# EAGLE design mainplate (EAGLE 8.6.0)
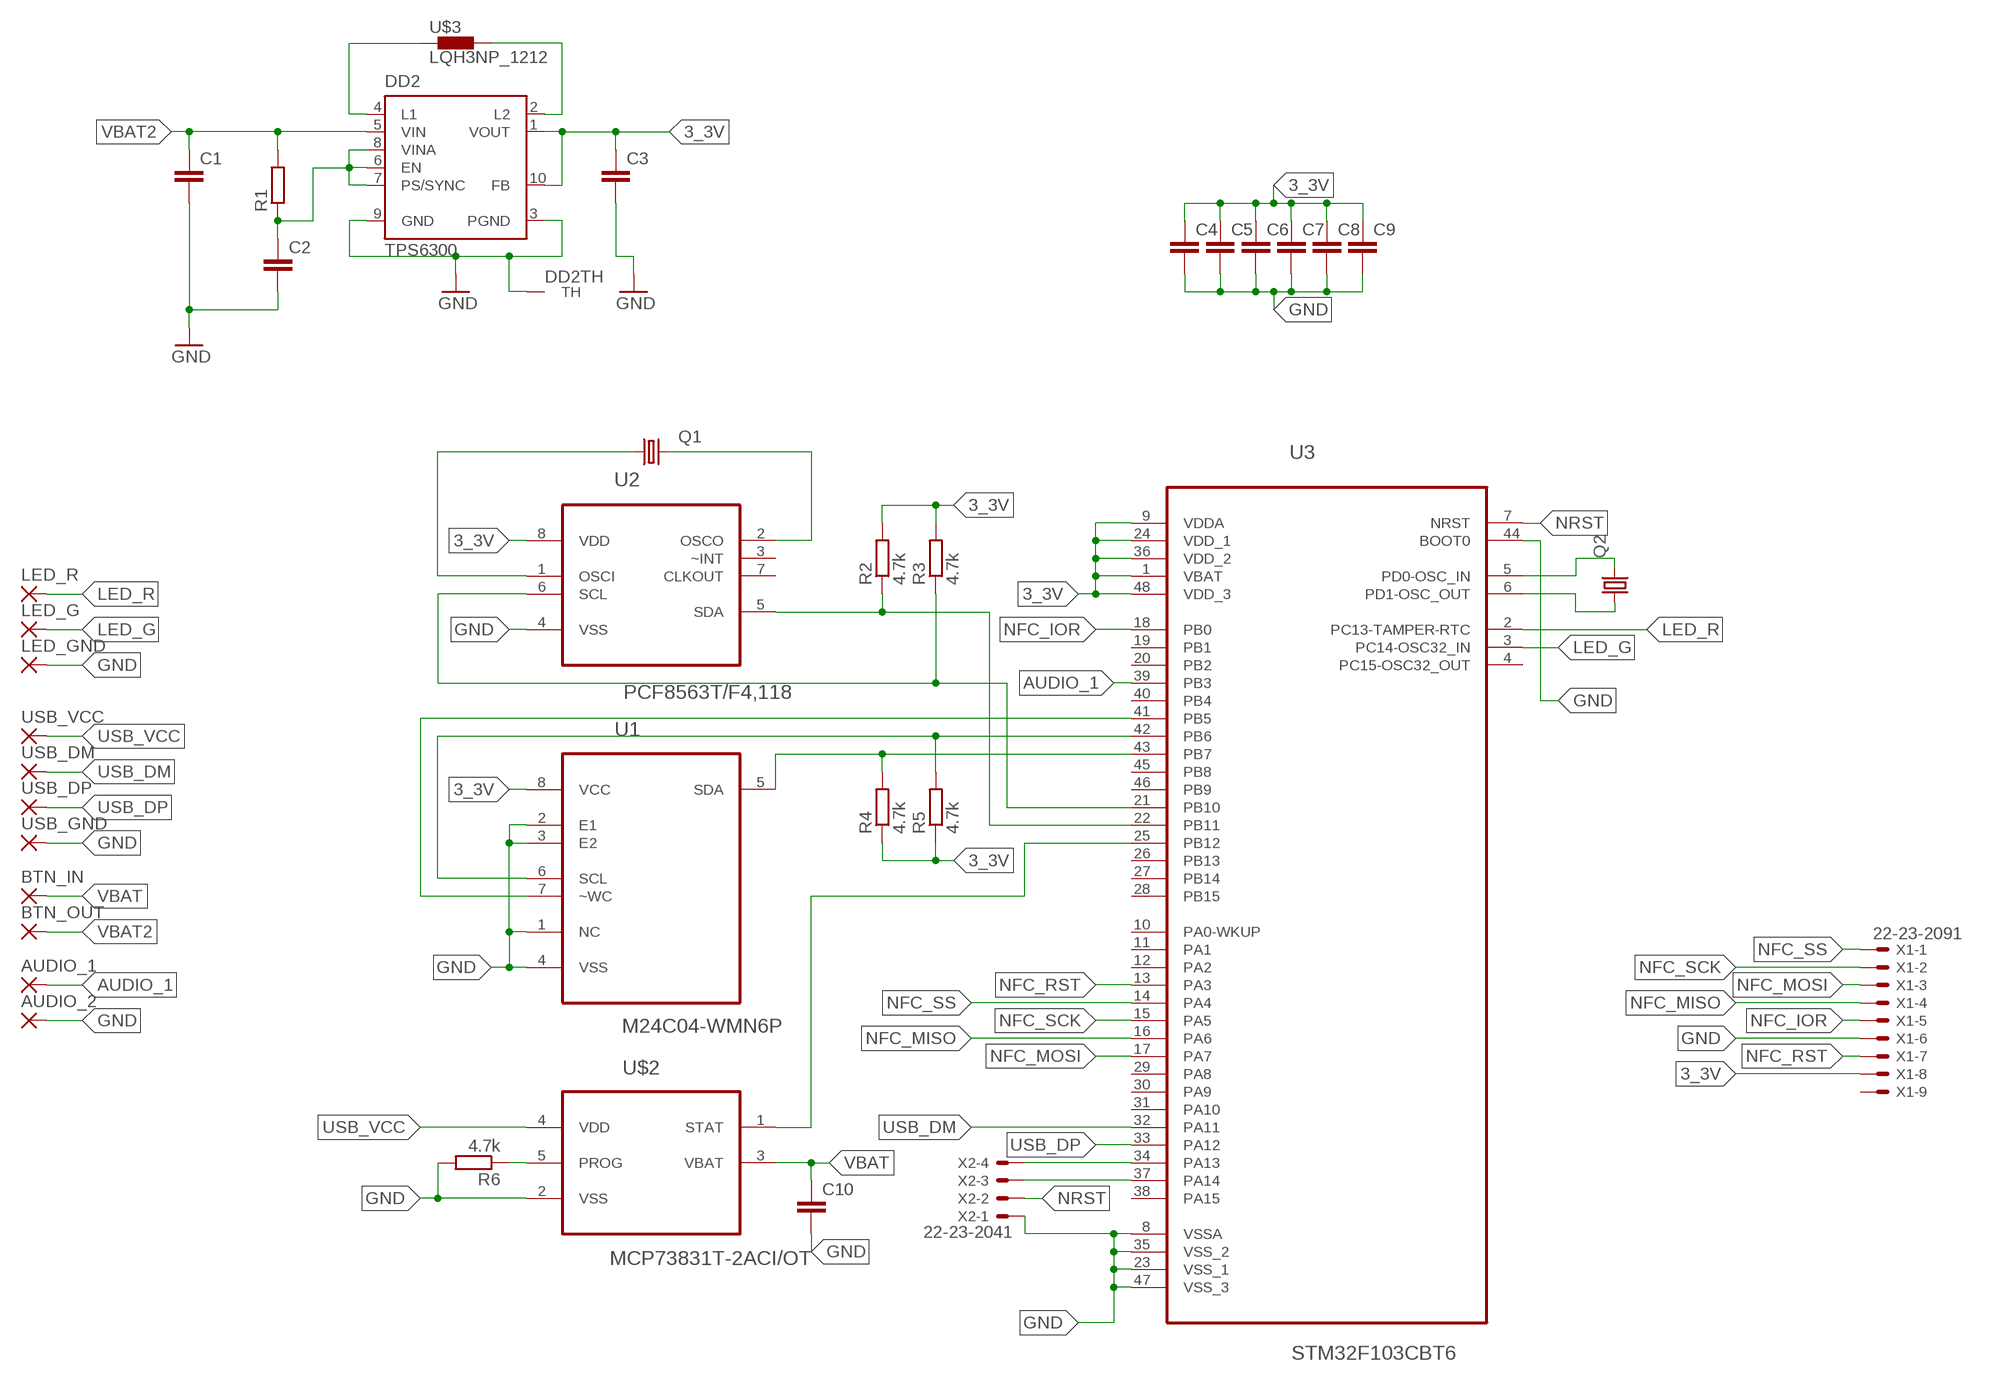
[diagram p0: schematic, sheet 1]

## Parts
AUDIO_1  2,54/1,0  [2,54/1,0]
AUDIO_2  2,54/1,0  [2,54/1,0]
BTN_IN  2,54/1,0  [2,54/1,0]
BTN_OUT  2,54/1,0  [2,54/1,0]
C1  C-EUC0603  [C0603]
C2  C-EUC0603  [C0603]
C3  C-EUC0603  [C0603]
C4  C-EUC0603  [C0603]
C5  C-EUC0603  [C0603]
C6  C-EUC0603  [C0603]
C7  C-EUC0603  [C0603]
C8  C-EUC0603  [C0603]
C9  C-EUC0603  [C0603]
C10  C-EUC0603  [C0603]
DD2  TPS6300  [DRC-S-PVSON-N10]
LED_G  2,54/1,0  [2,54/1,0]
LED_GND  2,54/1,0  [2,54/1,0]
LED_R  2,54/1,0  [2,54/1,0]
Q1  KX-327-NHT  [3.2X1.5]
Q2  KX-K  [11.4X4.5]
R1  R-EU_R0603  [R0603]
R2  4.7k  R-EU_R0603  [R0603]
R3  4.7k  R-EU_R0603  [R0603]
R4  4.7k  R-EU_R0603  [R0603]
R5  4.7k  R-EU_R0603  [R0603]
R6  4.7k  R-EU_R0603  [R0603]
U1  M24C04-WMN6P  [SOIC127P600X175-8N]
U2  PCF8563T/F4,118  [SOIC127P600X175-8N]
U3  STM32F103CBT6  [QFP50P900X900X160-48N]
U$2  MCP73831T-2ACI/OT  [SOT95P280X145-5N]
U$3  LQH3NP_1212  [LQH3NP_1212]
USB_DM  2,54/1,0  [2,54/1,0]
USB_DP  2,54/1,0  [2,54/1,0]
USB_GND  2,54/1,0  [2,54/1,0]
USB_VCC  2,54/1,0  [2,54/1,0]
X1  22-23-2091  [22-23-2091]
X2  22-23-2041  [22-23-2041]

## Nets
3_3V: C3.1 C4.1 C5.1 C6.1 C7.1 C8.1 C9.1 DD2.1(VOUT) DD2.10(FB) R2.2 R3.2 R4.1 R5.1 U1.8(VCC) U2.8(VDD) U3.1(VBAT) U3.9(VDDA) U3.24(VDD_1) U3.36(VDD_2) U3.48(VDD_3) X1.8
AUDIO_1: AUDIO_1.1(P) U3.39(PB3)
EE_WC: U1.7(~WC) U3.41(PB5)
GND: AUDIO_2.1(P) C1.2 C2.2 C3.2 C4.2 C5.2 C6.2 C7.2 C8.2 C9.2 C10.2 DD2.3(PGND) DD2.9(GND) DD2.TH LED_GND.1(P) R6.2 U1.1(NC) U1.2(E1) U1.3(E2) U1.4(VSS) U2.4(VSS) U3.8(VSSA) U3.23(VSS_1) U3.35(VSS_2) U3.44(BOOT0) U3.47(VSS_3) U$2.2(VSS) USB_GND.1(P) X1.6 X2.1
LED_G: LED_G.1(P) U3.3(PC14-OSC32_IN)
LED_R: LED_R.1(P) U3.2(PC13-TAMPER-RTC)
N$1: Q2.2 U3.5(PD0-OSC_IN)
N$2: Q2.1 U3.6(PD1-OSC_OUT)
N$3: DD2.4(L1) U$3.P$1
N$4: R2.1 U2.5(SDA) U3.22(PB11)
N$5: DD2.2(L2) U$3.P$2
N$6: R3.1 U2.6(SCL) U3.21(PB10)
N$7: R4.2 U1.5(SDA) U3.43(PB7)
N$8: C2.1 DD2.6(EN) DD2.7(PS/SYNC) DD2.8(VINA) R1.1
N$9: R5.2 U1.6(SCL) U3.42(PB6)
N$10: Q1.1 U2.1(OSCI)
N$11: Q1.2 U2.2(OSCO)
N$12: R6.1 U$2.5(PROG)
N$13: U3.34(PA13) X2.4
N$14: U3.37(PA14) X2.3
N$15: U3.25(PB12) U$2.1(STAT)
NFC_IOR: U3.18(PB0) X1.5
NFC_MISO: U3.16(PA6) X1.4
NFC_MOSI: U3.17(PA7) X1.3
NFC_RST: U3.13(PA3) X1.7
NFC_SCK: U3.15(PA5) X1.2
NFC_SS: U3.14(PA4) X1.1
NRST: U3.7(NRST) X2.2
USB_DM: U3.32(PA11) USB_DM.1(P)
USB_DP: U3.33(PA12) USB_DP.1(P)
USB_VCC: U$2.4(VDD) USB_VCC.1(P)
VBAT: BTN_IN.1(P) C10.1 U$2.3(VBAT)
VBAT2: BTN_OUT.1(P) C1.1 DD2.5(VIN) R1.2
Unconnected: U2.3(~INT) U2.7(CLKOUT) U3.4(PC15-OSC32_OUT) U3.10(PA0-WKUP) U3.11(PA1) U3.12(PA2) U3.19(PB1) U3.20(PB2) U3.26(PB13) U3.27(PB14) U3.28(PB15) U3.29(PA8) U3.30(PA9) U3.31(PA10) U3.38(PA15) U3.40(PB4) U3.45(PB8) U3.46(PB9) X1.9

## Library data of the parts
AUDIO_1 AUDIO_2 BTN_IN BTN_OUT LED_G LED_GND LED_R USB_DM USB_DP USB_GND USB_VCC = wirepad:2,54/1,0: THROUGH-HOLE PAD
C1-C10 = resistor:C-EU: CAPACITOR, European symbol
DD2 = texas:TPS6300*: HIGH EFFICIENT SINGLE INDUCTOR BUCK-BOOST CONVERTER WITH 1.8-A SWITCHES Source: http://focus.ti.com/lit/ds/symlink/tps63001.pdf; MPN: TPS63000DRCTG4; OC_FARNELL: 1511852; OC_NEWARK: 59M7217
Q1 = crystal-geyer_V1_0:KX-327: Tuning Fork Crystals (kHz) SMD: KX327 - Serie Model Size l/w/h [mm] Frequency Range Frequency Stability Temp. Range [°C] Load Capacitance AECQ 200 availabel Datasheet KX-327VT KX-327FT KX-327RT KX-327NHT KX-327NHF KX-327L KX-327S 1.25/1.05/0.5 1.6/1.0/0.5 2.0/1.2/0.6 3.2/1.5/0.8 3.2/1.5/0.8 7.0/1.5/1.4 8.2/3.8/2.5 32,768 kHz 32,768 kHz 32,768 kHz 32,768 kHz 32,768 kHz 32,768 kHz 32,768 kHz ±10 … ±20ppm ±10 … ±20ppm ±10 … ±20ppm ±10 … ±20ppm ±10 … ±20ppm ±10 … ±20ppm ±5 … ±20ppm (*) -40°C …+85°C (*) -40°C …+85°C (*) -40°C …+85°C (*) -40°C …+85°C (*) -40°C …+125°C (*) -40°C …+85°C (*) -40°C …+85°C 7/9/12,5 7/9/12,5 7/9/12,6 7/9/12,5 9/12,5 7/9/12,5 6/12,5 - - - - yes - - KX-327VT.pdf <http://www.geyer-electronic.de/uploads/tx_userartikelfrequenz/GEYER-KX-327VT.pdf> KX-327FT.pdf <http://www.geyer-electronic.de/uploads/tx_userartikelfrequenz/GEYER-KX-327FT.pdf> KX-327RT.pdf <http://www.geyer-electronic.de/uploads/tx_userartikelfrequenz/GEYER-KX-327RT.pdf> KX-327NHT.pdf <http://www.geyer-electronic.de/uploads/tx_userartikelfrequenz/GEYER-KX-327NHT.pdf> KX-327NHF.pdf <http://www.geyer-electronic.de/uploads/tx_userartikelfrequenz/GEYER-KX-327NHF.pdf> KX-327L.pdf <http://www.geyer-electronic.de/uploads/tx_userartikelfrequenz/GEYER-KX-327L.pdf> KX-327S.pdf <http://www.geyer-electronic.de/uploads/tx_userartikelfrequenz/GEYER-KX-327S.pdf> <http://www.geyer-electronic.de/fileadmin/template/img/logo-geyer-electronic.png> Details see: http://www.geyer-electronic.de/Frequenz-Produkte.9.0.html Created 2016-06-07, Hans Locher 2016 (C) Geyer Quartz Technology KX327VT,KX327FT,KX327RT,KX327NHT,KX327NHF,KX327S,KX327L;125105;1610;2012;3215;7015;8238;1,25x1,05,1.25x1.05;1,6x1,0,1.6x1.0;2,0x1,2,2.0x1.2;3,2x1,5,3.2x1.5;8,2x3,8,8.2x3.8,7.0x1.5,7,0x1,532.768kHz
Q2 = crystal-geyer_V1_0:KX: Quartz Crystals (MHz) SMD: KX - Serie Model Size l/w/h [mm] Frequency Range Frequency Stability Temp. Range [°C] Load Capacitance AECQ 200 availabel Datasheet KX-4 KX-5 KX-6 KX-7 KX-9A KX-9B KX-12A KX-12B KX-13 KX-20 KX-K KX-KS 1.6/1.2/0.3 2.0/1.6/0.45 2.5/2.0/0.55 3.2/2.5/0.8 5.0/3.2/1.0 5.0/3.2/1.1 6.0/3.5/1.1 6.0/3.5/1.0 7.0/5.0 /1.3 11.6/5.5/1.6 12.3/4.5/4.2 12.3/4.5/3.2 24.0 ~ 80.0 MHz 16.0 ~ 80.0 MHz 12.0 ~ 80.0 MHz 8.0 ~ 60.0 MHz 7,68 ~ 300,0 MHz 8,0 ~ 50,0 MHz 8,0 ~ 150,0 MHz 8,0 ~ 50,0 MHz 6,0 ~ 160,0 MHz 3,579 ~ 25,0 MHz 3,579 ~ 70,0 MHz 3,579 ~ 70,0 MHz ±10 … ±50ppm ±10 … ±50ppm ±10 … ±50ppm ±10 … ±50ppm ±10 … ±50ppm ±10 … ±50ppm ±10 … ±50ppm ±10 … ±50ppm ±10 … ±50ppm ±50ppm ±10 … ±50ppm ±10 … ±50ppm (*) -40°C …+85°C (*) -40°C …+125°C (*) -40°C …+125°C (*) -40°C …+125°C (*) -40°C …+105°C (*) -40°C …+105°C (*) -40°C …+125°C (*) -40°C …+105°C (*) -40°C …+105°C (*) -40°C …+105°C (*) -40°C …+85°C (*) -40°C …+85°C 8, 8…16 8, 8…16 10, 8…16 12, 7…20 16, 10…20 16, 10…20 16, 10…20 16, 12…20 16, 12…20 16, 12…20 16, 12…30 16, 12…30 - yes yes yes - - - - - - - - KX-4.pdf <http://www.geyer-electronic.de/uploads/tx_userartikelfrequenz/GEYER-KX-4.pdf> KX-5.pdf <http://www.geyer-electronic.de/uploads/tx_userartikelfrequenz/GEYER-KX-5.pdf> KX-6.pdf <http://www.geyer-electronic.de/uploads/tx_userartikelfrequenz/GEYER-KX-6.pdf> KX-7.pdf <http://www.geyer-electronic.de/uploads/tx_userartikelfrequenz/GEYER-KX-7.pdf> KX-9A.pdf <http://www.geyer-electronic.de/uploads/tx_userartikelfrequenz/GEYER-KX-9A.pdf> KX-9B.pdf <http://www.geyer-electronic.de/uploads/tx_userartikelfrequenz/GEYER-KX-9B.pdf> KX-12A.pdf <http://www.geyer-electronic.de/uploads/tx_userartikelfrequenz/GEYER-KX-12A.pdf> KX-12B.pdf <http://www.geyer-electronic.de/uploads/tx_userartikelfrequenz/GEYER-KX-12B.pdf> KX-13.pdf <http://www.geyer-electronic.de/uploads/tx_userartikelfrequenz/GEYER-KX-13.pdf> KX-20.pdf <http://www.geyer-electronic.de/uploads/tx_userartikelfrequenz/GEYER-KX-20.pdf> KX-K.pdf <http://www.geyer-electronic.de/uploads/tx_userartikelfrequenz/GEYER-KX-K.pdf> KX-KS.pdf <http://www.geyer-electronic.de/uploads/tx_userartikelfrequenz/GEYER-KX-KS.pdf> <http://www.geyer-electronic.de/fileadmin/template/img/logo-geyer-electronic.png> Details see: http://www.geyer-electronic.de/Frequenz-Produkte.9.0.html Created 2016-06-07, Hans Locher 2016 (C) Geyer Quartz Technology KX4,KX5,KX6,KX7,KX9A,KX9B,KX12A,KX12B,KX13,KX20,KXK,KXKS;1612;2016;2520;3225;5032;6035;7050;11655;12345;1,6x1,2;2,0x1,6;2,5x2,0;3,2x2,5;5,0x3,2;6,0x3,5;7,0x5,0;11,6x5,5;12,3x4,5;12,3x4,5;1.6x1.2;2.0x1.6;2.5x2.0;3.2x2.5;5.0x3.2;6.0x3.5;7.0x5.0;11.6x5.5;12.3x4.5;12.3x4.5;
R1-R6 = resistor:R-EU_: RESISTOR, European symbol
U1 = ST Microelctronics_By_element14_Batch_1:M24C04-WMN6P: EEPROM; MPN: M24C04-WMN6P; OC_FARNELL: 9882812; OC_NEWARK: 83K1376; PACKAGE: SOIC-8; SUPPLIER: STMICROELECTRONICS
U2 = NXP_By_element14_Batch_1:PCF8563T/F4,118: Real-time clock/calendar; MPN: PCF8563T/F4,118; OC_FARNELL: 1826830; OC_NEWARK: 78R6249; PACKAGE: SOIC-8; SUPPLIER: NXP Semiconductors
U3 = ST Microelctronics_By_element14_Batch_1:STM32F103CBT6: Medium-density performance line ARM-based 32-bit MCU; MPN: STM32F103CBT6; OC_FARNELL: 1606327; OC_NEWARK: 11N8296; PACKAGE: QFP-48; SUPPLIER: STMICROELECTRONICS
U$2 = Microchip_By_element14_Batch_1:MCP73831T-2ACI/OT: Charge Management Controller; MPN: MCP73831T-2ACI/OT; OC_FARNELL: 1332158; OC_NEWARK: 56K7045; PACKAGE: SOT-5; SUPPLIER: Microchip
U$3 = inductors:LQH3NP_1212
X1 = con-molex:22-23-2091: .100" (2.54mm) Center Header - 9 Pin; MF: MOLEX; MPN: 22-23-2091; OC_FARNELL: 1756827; OC_NEWARK: 56H0450
X2 = con-molex:22-23-2041: .100" (2.54mm) Center Header - 4 Pin; MF: MOLEX; MPN: 22-23-2041; OC_FARNELL: 1462920; OC_NEWARK: 38C0355

## Board
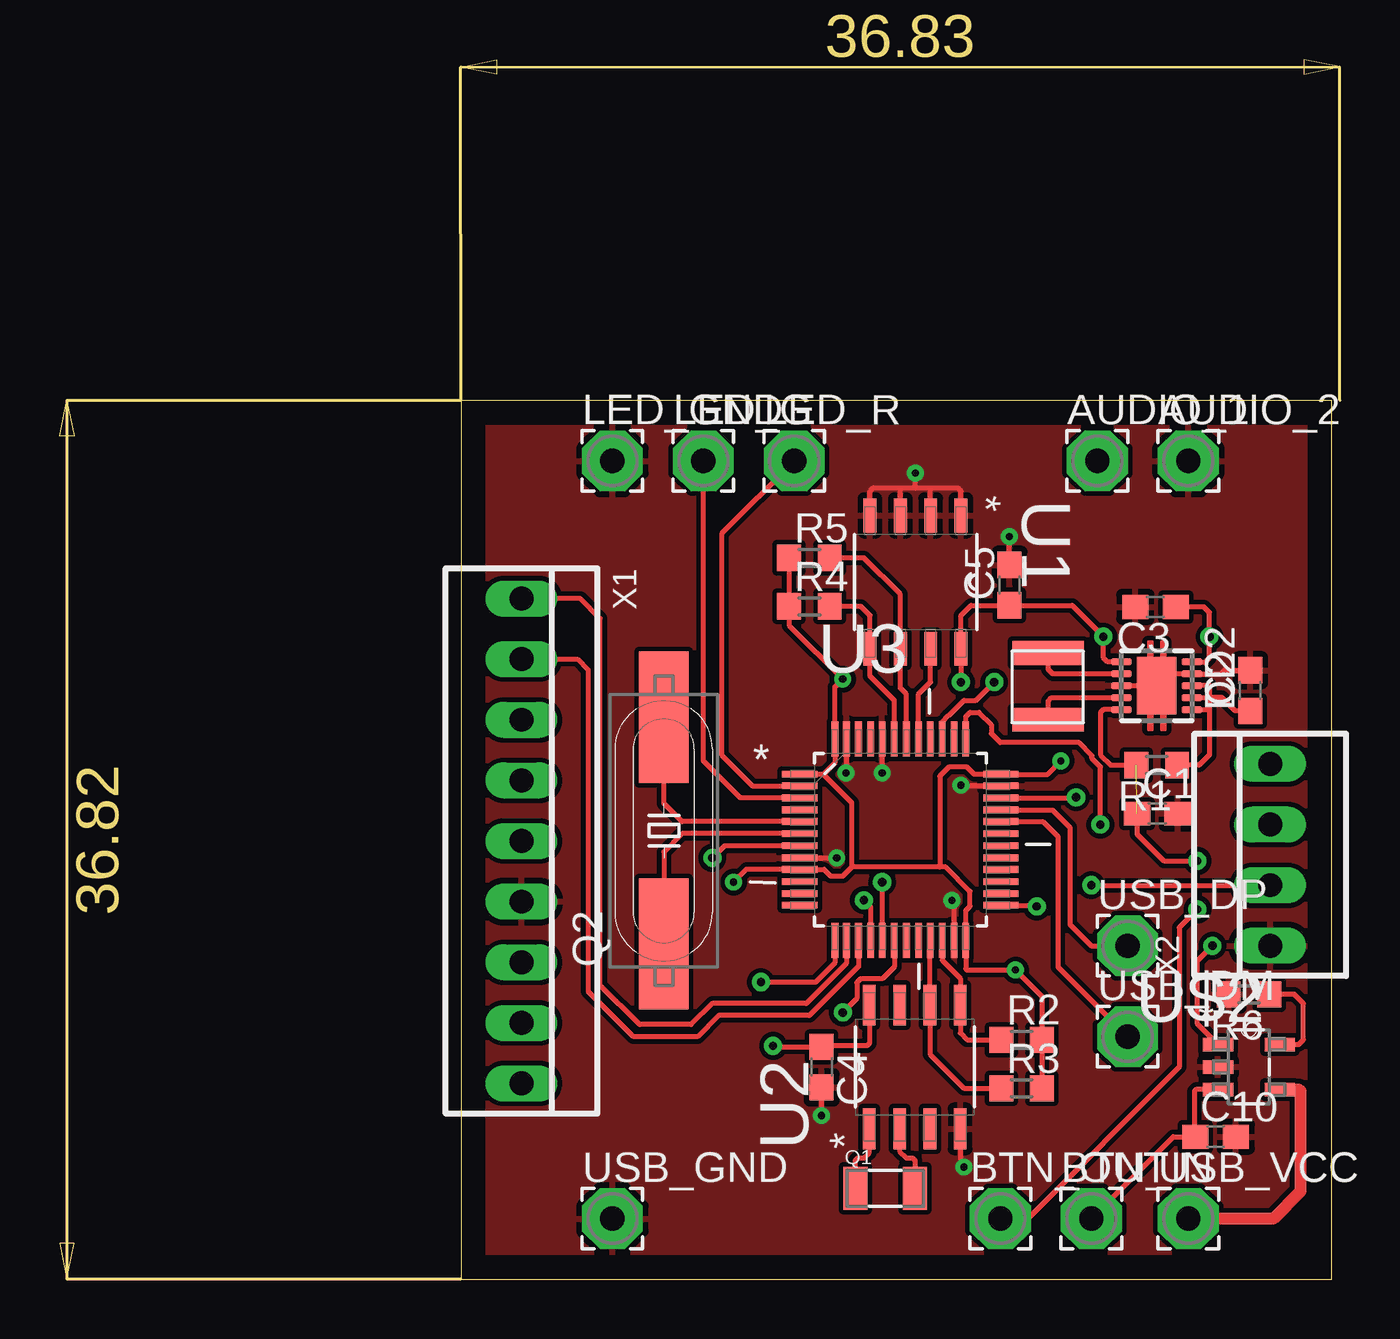
[diagram p1: board, top side]
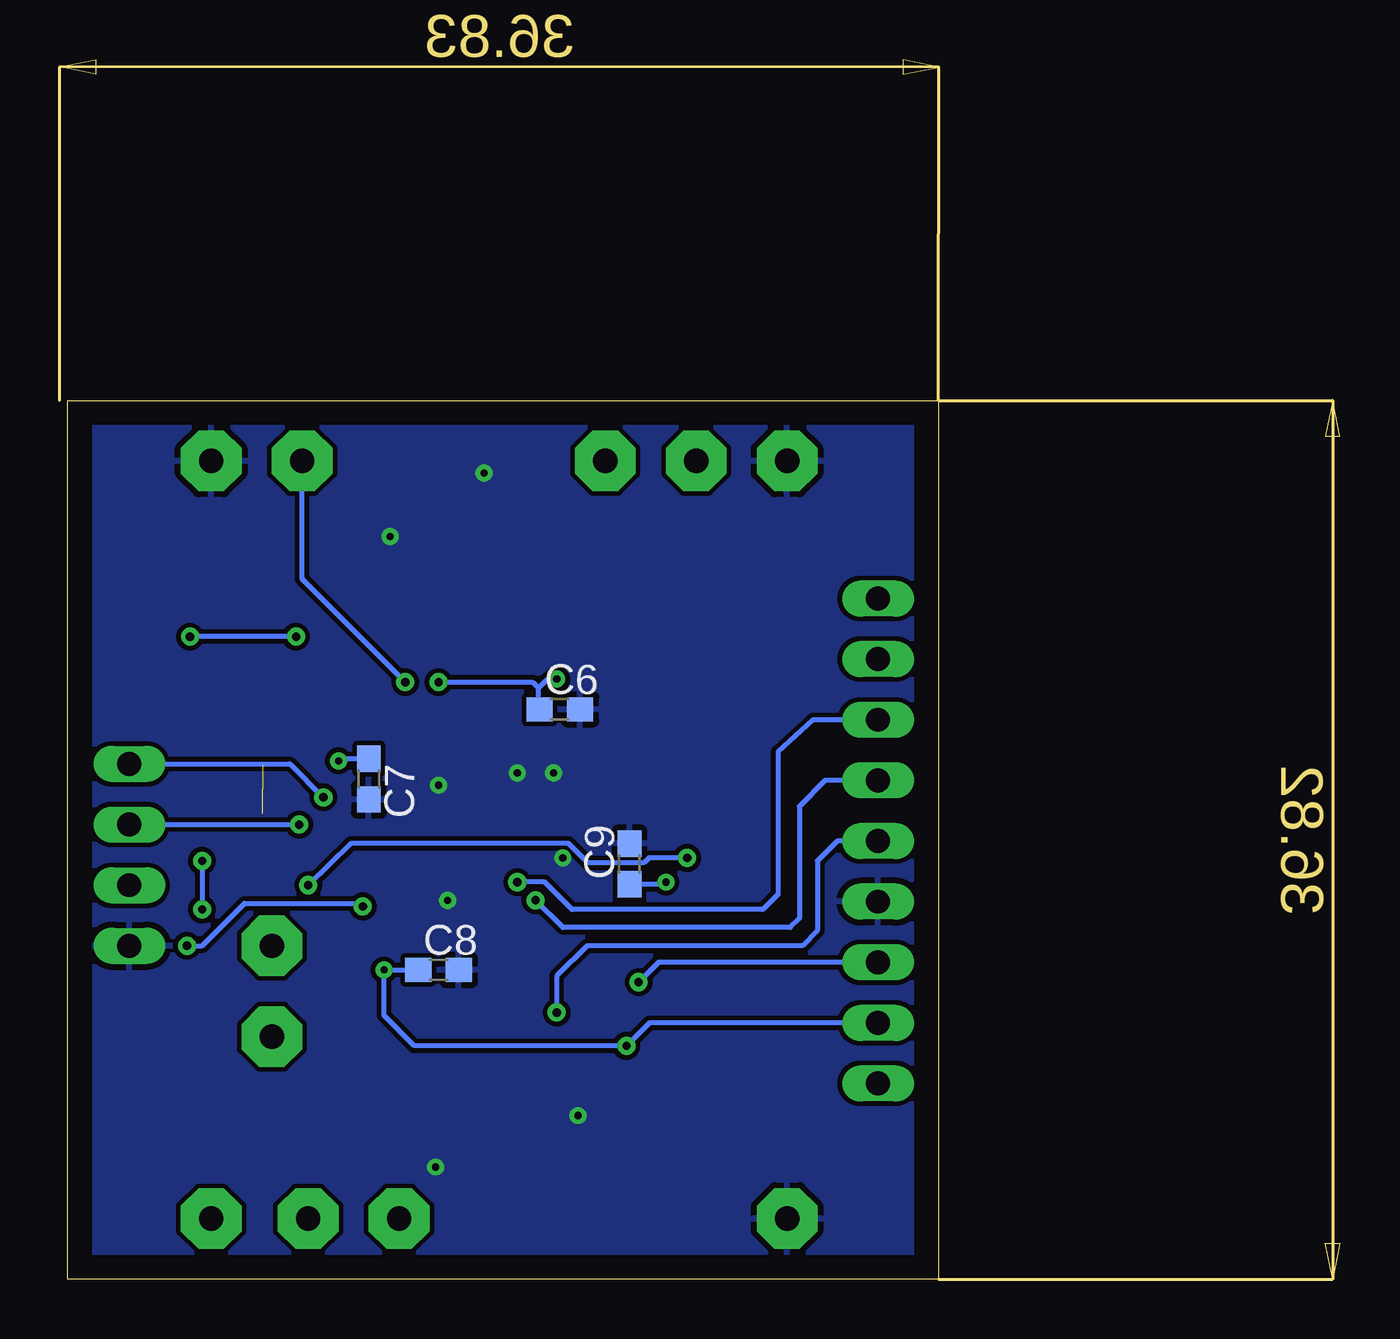
[diagram p2: board, bottom side, seen from below]

Size 36.5 x 36.82 mm. Coordinates in mm from the lower left corner, seen from the top.
Outline: 0,0 36.5,0 36.5,36.82 0,36.82 0,0
Copper layers (1*16): Top 0.035mm / dielectric 1.5mm / Bottom 0.035mm
Design rules "default": minimum track width 6mil, minimum drill 0.35mm, track to track 6mil, track to pad 6mil, pad to pad 6mil, via to via 6mil, smd to smd 6mil, copper to edge 40mil, drill to drill 6mil, minimum pad ring 10mil, minimum via ring 8mil, stop-mask expansion 4mil, vias tented up to drill 0mil, thermal gap 10mil

### Footprints (pad centres in the part's own frame; a part is rotated, then mirrored left to right if it is on the bottom)
2,54/1,0 = drill 1.016 pad 2.54 octagon: 1 0,0
C0603 = smd 1.1 x 1: 1 -0.85,0; 2 0.85,0
DRC-S-PVSON-N10 = smd 0.28 x 0.85: 1 -1,-1.475; 2 -0.5,-1.475; 3 0,-1.475; 4 0.5,-1.475; 5 1,-1.475; 6 1,1.475; 7 0.5,1.475; 8 0,1.475; 9 -0.5,1.475; 10 -1,1.475 | smd 2.4 x 1.65: TH 0,0
3.2X1.5 = smd 1 x 1.8: 1 -1.25,0; 2 1.25,0
11.4X4.5 = smd 5.5 x 2.08: 1 -4.75,0; 2 4.75,0
R0603 = smd 1 x 1.1: 1 -0.85,0; 2 0.85,0
SOIC127P600X175-8N = smd 1.422 x 0.533: 1 -2.794,1.905; 2 -2.794,0.635; 3 -2.794,-0.635; 4 -2.794,-1.905; 5 2.794,-1.905; 6 2.794,-0.635; 7 2.794,0.635; 8 2.794,1.905
SOIC127P600X175-8N' = smd 1.702 x 0.533: 1 -2.591,1.905; 2 -2.591,0.635; 3 -2.591,-0.635; 4 -2.591,-1.905; 5 2.591,-1.905; 6 2.591,-0.635; 7 2.591,0.635; 8 2.591,1.905
QFP50P900X900X160-48N = smd 1.473 x 0.279: 1 -4.216,2.743; 2 -4.216,2.261; 3 -4.216,1.753; 4 -4.216,1.245; 5 -4.216,0.762; 6 -4.216,0.254; 7 -4.216,-0.254; 8 -4.216,-0.762; 9 -4.216,-1.245; 10 -4.216,-1.753; 11 -4.216,-2.261; 12 -4.216,-2.743; 25 4.216,-2.743; 26 4.216,-2.261; 27 4.216,-1.753; 28 4.216,-1.245; 29 4.216,-0.762; 30 4.216,-0.254; 31 4.216,0.254; 32 4.216,0.762; 33 4.216,1.245; 34 4.216,1.753; 35 4.216,2.261; 36 4.216,2.743 | smd 0.279 x 1.473: 13 -2.743,-4.216; 14 -2.261,-4.216; 15 -1.753,-4.216; 16 -1.245,-4.216; 17 -0.762,-4.216; 18 -0.254,-4.216; 19 0.254,-4.216; 20 0.762,-4.216; 21 1.245,-4.216; 22 1.753,-4.216; 23 2.261,-4.216; 24 2.743,-4.216; 37 2.743,4.216; 38 2.261,4.216; 39 1.753,4.216; 40 1.245,4.216; 41 0.762,4.216; 42 0.254,4.216; 43 -0.254,4.216; 44 -0.762,4.216; 45 -1.245,4.216; 46 -1.753,4.216; 47 -2.261,4.216; 48 -2.743,4.216
SOT95P280X145-5N = smd 1.27 x 0.559: 1 -1.295,0.94; 2 -1.295,0; 3 -1.295,-0.94; 4 1.295,-0.94; 5 1.295,0.94
LQH3NP_1212 = smd 1 x 3: P$1 0.127,-1.524; P$2 2.921,-1.524
22-23-2091 = drill 1 long: 1 -10.16,0; 2 -7.62,0; 3 -5.08,0; 4 -2.54,0; 5 0,0; 6 2.54,0; 7 5.08,0; 8 7.62,0; 9 10.16,0
22-23-2041 = drill 1 long: 1 -3.81,0; 2 -1.27,0; 3 1.27,0; 4 3.81,0

### Placement (x,y rotation side)
AUDIO_1  26.67,34.29 0 top
AUDIO_2  30.48,34.29 0 top
BTN_IN  26.42,2.54 0 top
BTN_OUT  22.61,2.54 0 top
C1  29.18,19.51 0 top
C2  33.07,24.66 90 top
C3  29.11,28.17 180 top
C4  15.11,8.89 270 top
C5  22.99,29.08 90 top
C6  15.88,23.88 0 bottom
C7  23.88,20.96 270 bottom
C8  20.95,12.95 0 bottom
C9  12.95,17.4 90 bottom
C10  31.62,5.97 0 top
DD2  29.16,24.87 270 top
LED_G  10.16,34.29 0 top
LED_GND  6.35,34.29 0 top
LED_R  13.97,34.29 0 top
Q1  17.78,3.81 0 top
Q2  8.51,18.8 90 top
R1  29.16,21.54 180 top
R2  23.5,10.03 0 top
R3  23.5,8 0 top
R4  14.61,28.19 0 top
R5  14.61,30.23 0 top
R6  33.02,11.94 180 top
U1  19.05,29.21 270 top
U2  PCF8563T/F4,118  [SOIC127P600X175-8N']  19.02,8.89 90 top
U3  18.41,18.41 0 top
U$2  33.02,8.89 0 top
U$3  23.09,23.32 90 top
USB_DM  27.94,10.16 0 top
USB_DP  27.94,13.97 0 top
USB_GND  6.35,2.54 0 top
USB_VCC  30.48,2.54 0 top
X1  2.54,18.36 270 top
X2  33.91,17.78 90 top

### Tracks (layer width: path | path; a pad name or v marks a point on that pad's centre or on a via)
3_3V  (via drill 0.3 pad 0.7, 0.35)
  Top 0.2: 15.19,21.16 U3.1 | 15.19,21.16 15.67,21.64 U3.48 15.67,24.82 v16,25.15 13.76,27.39 R4.1 R5.1 | 16.38,17.27 16,16.89 15.49,16.89 15.21,17.17 U3.9 11.96,17.17 v11.43,16.64 | 16.38,17.27 16.38,19.96 15.19,21.16 | 20.07,17.27 20.32,17.27 21.34,16.26 21.34,15.62 21.16,15.44 U3.24 21.16,13.01 21.21,12.95 v23.24,12.95 24.34,11.85 R2.2 R3.2 | 20.07,17.27 16.38,17.27 | 20.07,17.27 20.07,21.08 20.45,21.46 21.21,21.46 21.51,21.16 U3.36 24.59,21.16 v25.15,21.72 | DD2.10 31.2,25.87 31.37,26.04 v31.37,26.92 31.37,27.94 31.14,28.17 C3.1 | U2.8 17.11,9.88 17.02,9.78 15.15,9.78 C4.1 13.12,9.74 v13.08,9.78 | DD2.1 27.09,25.87 26.92,26.04 v26.92,26.92 25.61,28.23 C5.1 21.38,28.23 20.95,27.81 U1.8 v20.95,25.02
  Bottom 0.2: C7.1 25.06,21.8 v25.15,21.72 | v16,25.15 16.38,25.15 16.76,24.76 | C6.1 16.76,23.91 16.76,24.76 | v11.43,16.64 11.52,16.55 C9.1 | C8.1 v23.24,12.95 23.24,11.05 21.97,9.78 v13.08,9.78 12.12,10.74 X1.8 | v26.92,26.92 v31.37,26.92 | v20.95,25.02 17.02,25.02 16.76,24.76
AUDIO_1  (via drill 0.35)
  Top 0.2: U3.39 20.17,23.36 20.43,23.62 20.45,23.62 21.08,24.26 21.59,24.26 v22.35,25.02
  Bottom 0.2: v22.35,25.02 26.67,29.34 AUDIO_1.1
EE_WC
  Top 0.2: U3.41 19.18,24.51 19.68,25.02 U1.7
GND  (via drill 0.3 pad 0.7)
  Top 0.2: U3.44 v17.65,21.21 | U3.8 v15.75,17.65 | U3.35 20.98,20.68 v20.95,20.7 | U3.47 16.15,21.23 v16.13,21.21 | U3.23 20.68,15.77 v20.57,15.88 | U2.4 20.93,4.86 v21.08,4.7 | C4.2 v15.11,6.86 | U1.4 17.14,33.02 17.27,33.15 18.41,33.15 | U1.1 20.95,33.02 20.83,33.15 19.68,33.15 | 19.68,33.15 19.05,33.15 | 19.05,33.15 18.41,33.15 | U1.2 19.68,33.15 | U1.3 18.41,33.15 | 19.05,33.15 v19.05,33.78 | C5.2 v22.99,31.12 | DD2.3 DD2.TH 29.66,25.37 DD2.9 31.84,25.37 32,25.53 32.02,25.51 C2.2
  pour Bottom (isolate 0.2): 0,36.83 0,0 36.83,0 36.83,36.83
  pour Top (isolate 0.2): 0,36.83 0,0 36.83,0 36.83,36.83
LED_G
  Top 0.2: LED_G.1 10.16,21.72 11.71,20.17 U3.3
LED_R
  Top 0.2: LED_R.1 10.92,31.24 10.92,21.97 12.22,20.68 U3.2
N$1
  Top 0.2: U3.5 9.27,19.18 8.51,19.94 Q2.2
N$2
  Top 0.2: U3.6 9.27,18.67 8.51,17.91 Q2.1
N$3
  Top 0.2: DD2.4 24.75,24.37 24.61,24.23 U$3.P$1
N$4
  Top 0.2: U3.22 20.17,13.36 20.93,12.6 U2.5 20.93,10.32 21.21,10.03 R2.1
N$5
  Top 0.2: DD2.2 24.8,25.37 24.61,25.55 U$3.P$2
N$6
  Top 0.2: U3.21 U2.6 19.66,9.43 21.08,8 R3.1
N$7
  Top 0.2: U3.43 18.16,24.26 17.14,25.27 U1.5 17.14,27.81 16.76,28.19 R4.2
N$8
  Top 0.2: DD2.7 31.35,24.37 31.37,24.38 | 31.37,24.38 31.37,24.89 30.66,24.89 DD2.8 | DD2.6 31.36,23.87 31.37,23.88 | 31.37,24.38 31.37,23.88 | C2.1 32.45,23.81 31.88,24.38 31.37,24.38 | 31.37,23.88 31.37,21.97 30.94,21.54 R1.1
N$9
  Top 0.2: U3.42 18.67,24.51 18.41,24.76 U1.6 18.41,28.7 16.89,30.23 R5.2
N$10
  Top 0.2: Q1.1 16.53,4.97 16.64,5.08 16.89,5.08 17.11,5.3 U2.1
N$11
  Top 0.2: U2.2 18.39,5.36 18.67,5.08 18.92,5.08 19.03,4.97 Q1.2
N$12
  Top 0.2: U$2.5 35.1,9.83 35.31,10.03 35.31,11.56 34.92,11.94 R6.1
N$13  (via drill 0.35)
  Top 0.2: U3.34 25.76,20.17 v25.78,20.19
  Bottom 0.2: X2.4 27.18,21.59 v25.78,20.19
N$14  (via drill 0.35)
  Top 0.2: v26.8,19.05 26.8,21.47 26.45,21.82 26.45,21.94 25.91,22.48 22.61,22.48 22.23,22.86 22.23,23.24 21.72,23.75 21.34,23.75 21.16,23.57 U3.37
  Bottom 0.2: X2.3 v26.8,19.05
N$15  (via drill 0.35)
  Top 0.2: U$2.1 30.86,10.69 30.86,13.34 v31.5,13.97 | U3.25 24.08,15.67 v24.13,15.62
  Bottom 0.2: v31.5,13.97 30.86,13.97 29.08,15.75 24.26,15.75 v24.13,15.62
NFC_IOR  (via drill 0.35)
  Top 0.2: U3.18 18.16,13.08 17.66,12.58 16.74,12.58 16.6,12.44 16.6,11.77 v16,11.18
  Bottom 0.2: X1.5 4.25,18.36 5.08,17.53 5.08,14.6 5.71,13.97 14.73,13.97 16,12.7 v16,11.18
NFC_MISO  (via drill 0.35)
  Top 0.2: v16.89,15.88 17.17,15.6 U3.16
  Bottom 0.2: X1.4 4.75,20.9 5.84,19.81 5.84,15.11 6.22,14.73 15.75,14.73 v16.89,15.88
NFC_MOSI  (via drill 0.35)
  Top 0.2: v17.65,16.64 U3.17
  Bottom 0.2: X1.3 5.26,23.44 6.73,22.1 6.73,16.13 7.37,15.49 15.37,15.49 16.51,16.64 v17.65,16.64
NFC_RST  (via drill 0.35)
  Top 0.2: U3.13 15.67,13.26 14.86,12.45 v12.57,12.45
  Bottom 0.2: X1.7 11.74,13.28 v12.57,12.45
NFC_SCK
  Top 0.2: U3.15 16.66,13.11 14.61,11.05 10.79,11.05 9.91,10.16 7.24,10.16 5.33,12.06 5.33,25.53 4.88,25.98 X1.2
NFC_SS
  Top 0.2: U3.14 16.15,13.23 14.48,11.56 10.54,11.56 9.65,10.67 7.49,10.67 5.84,12.32 5.84,27.69 5.01,28.52 X1.1
NRST  (via drill 0.35)
  Top 0.2: U3.7 11.05,18.16 v10.54,17.65 | v26.42,16.51 X2.2
  Bottom 0.2: v10.54,17.65 12.14,17.65 12.35,17.45 14.69,17.45 15.5,18.26 24.61,18.26 v26.42,16.51
USB_DM
  Top 0.2: U3.32 24.38,19.18 25.02,18.54 25.02,13.08 USB_DM.1
USB_DP
  Top 0.2: U3.33 24.79,19.66 25.53,18.92 25.53,14.86 26.42,13.97 USB_DP.1
USB_VCC
  Top 0.5: U$2.4 35.1,7.95 35.18,7.87 35.18,3.68 34.04,2.54 USB_VCC.1
VBAT
  Top 0.2: U$2.3 30.81,7.95 30.73,7.87 30.73,6.1 30.86,5.97 C10.1 29.84,5.97 BTN_IN.1
VBAT2  (via drill 0.35)  (1 unrouted)
  Top 0.2: DD2.5 26.91,23.87 26.8,23.75 26.8,21.97 27.23,21.54 R1.2 | C1.1 28.34,18.66 29.46,17.53 v30.86,17.53 | v30.86,15.49 30.1,14.73 30.1,8.89 23.75,2.54 BTN_OUT.1
  Bottom 0.2: v30.86,17.53 v30.86,15.49